# Altium schematic sheet 5V0 +12V0 rails.SchDoc
size A
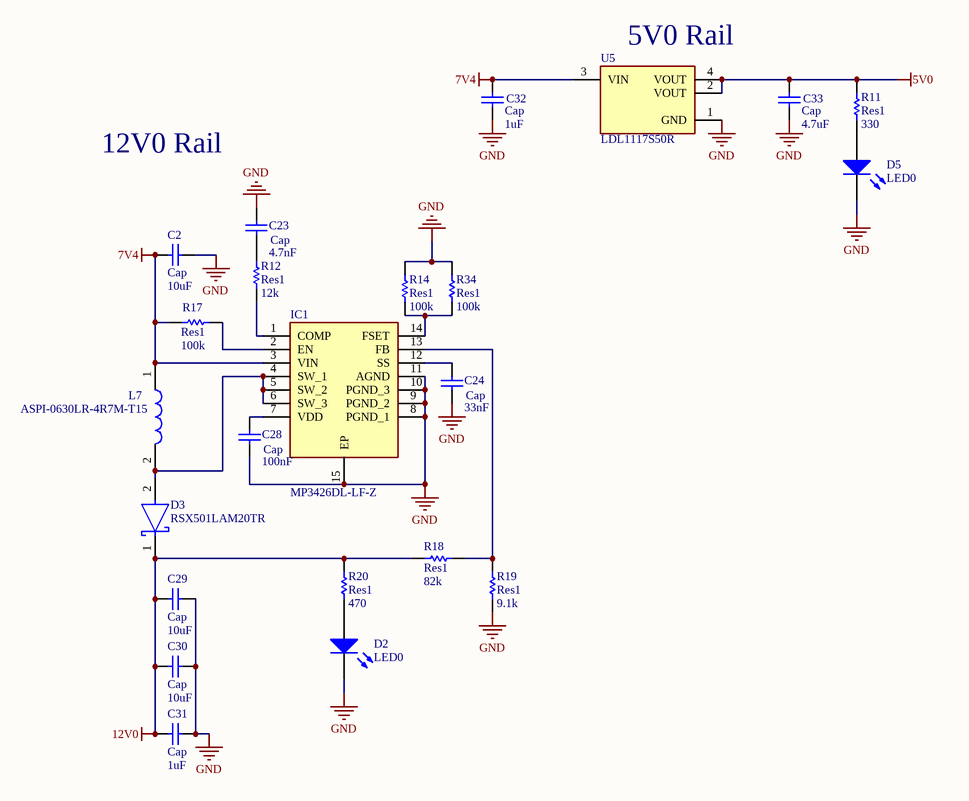
[diagram p0: 5V0 +12V0 rails.SchDoc]

## Parts
C2  Cap  value 10uF  [6-0805_M]
C23  Cap  value 4.7nF  [0402-A]
C24  Cap  value 33nF  [0402-A]
C28  Cap  value 100nF  [1608[0603]]
C29  Cap  value 10uF  [6-0805_M]
C30  Cap  value 10uF  [6-0805_M]
C31  Cap  value 1uF  [1608[0603]]
C32  Cap  value 1uF  [1608[0603]]
C33  Cap  value 4.7uF  [1608[0603]]
D2  LED0  [1608[0603]]
D3  RSX501LAM20TR  [FP-PMDTM-MFG]
D5  LED0  [1608[0603]]
IC1  MP3426DL-LF-Z  [SON50P300X400X100-15N-D]
L7  ASPI-0630LR-4R7M-T15  [ASPI-0630LR]
R11  Res1  value 330  [0402-A]
R12  Res1  value 12k  [0402-A]
R14  Res1  value 100k  [0402-A]
R17  Res1  value 100k  [0402-A]
R18  Res1  value 82k  [0402-A]
R19  Res1  value 9.1k  [0402-A]
R20  Res1  value 470  [6-0805_M]
R34  Res1  value 100k  [0402-A]
U5  LDL1117S50R  [FP-SOT-223-0046067_14-MFG]

## Nets
5V0: C33.2 R11.2 U5.2(VOUT) U5.4(VOUT)
7V4: C2.2 C32.2 IC1.3(VIN) L7.1 R17.2 U5.3(VIN)
12V0: C29.2 C30.2 C31.2 D3.1(C) R18.2 R20.2
GND: C2.1 C23.2 C24.1 C28.1 C29.1 C30.1 C31.1 C32.1 C33.1 D2.2(K) D5.2(K) IC1.8(PGND_1) IC1.9(PGND_2) IC1.10(PGND_3) IC1.11(AGND) IC1.15(EP) R14.1 R19.1 R34.1 U5.1(GND)
NetC23_1: C23.1 R12.1
NetC24_2: C24.2 IC1.12(SS)
NetC28_2: C28.2 IC1.7(VDD)
NetD2_1: D2.1(A) R20.1
NetD3_2: D3.2(A) IC1.4(SW_1) IC1.5(SW_2) IC1.6(SW_3) L7.2
NetD5_1: D5.1(A) R11.1
NetIC1_1: IC1.1(COMP) R12.2
NetIC1_2: IC1.2(EN) R17.1
NetIC1_13: IC1.13(FB) R18.1 R19.2
NetIC1_14: IC1.14(FSET) R14.2 R34.2

## Notes on the sheet
- (near U5) 5V0 Rail
- 12V0 Rail

## Library data of the parts
C2 C23 C24 C28-C33 = Cap: Capacitor; Published: 8-Jun-2000; LatestRevisionDate: 17-Jul-2002; LatestRevisionNote: Re-released for DXP Platform.; PackageReference: RAD-0.3; Publisher: Altium Limited; PackageDescription: Radial Cap, Thru-Hole; 2 Leads; 0.3 in Pin Spacing
D3 = CMP-08971-000008-1: DIODE SCHOTTKY 20V 5A PMDTM; Manufacturer: Rohm; Max Surge Forward Current: 100A; Max Junction Temp: +125°C; Max Repetitive Reverse Voltage: 25V; Peak Reverse Current: 500uA; Automotive: No; Digikey Description: DIODE SCHOTTKY 20V 5A PMDTM; Temperature Range High: +125°C; Height: 1.05mm; Octopart: https://octopart.com/rsx501lam20tr-rohm-82270774; Lead Free: Yes; ComponentLink2URL: https://fscdn.rohm.com/en/products/databook/datasheet/discrete/diode/schottky_barrier/rsx501lam20tr-e.pdf; Device Class L2: Diodes; ComponentLink2Description: Datasheet; Device Class L1: Discrete Semiconductors; RoHS: TRUE; Reverse Voltage: 20V; Package: PMDTM; Category: Diode; Temperature: to +125°C; Device Class L3: Schottky Diodes; Manufacturer Part Number: RSX501LAM20TR; Forward Current: 5A
IC1 = MP3426DL-LF-Z: Integrated Circuit; Manufacturer_Name: Monolithic Power Systems (MPS); Datasheet Link: https://www.monolithicpower.com/en/documentview/productdocument/index/version/2/document_type/Datasheet/lang/en/sku/MP3426/; Height: 1mm; Manufacturer_Part_Number: MP3426DL-LF-Z; Mouser Part Number: 946-MP3426DL-LF-Z; Mouser Price/Stock: https://www.mouser.co.uk/ProductDetail/Monolithic-Power-Systems-MPS/MP3426DL-LF-Z?qs=Z3CaLxJiOJL0MxCuEKYvhQ%3D%3D
L7 = ASPI-0630LR-4R7M-T15: Inductor; Manufacturer_Name: ABRACON; Datasheet Link: http://www.abracon.com/Magnetics/power/ASPI-0630LR.pdf; Manufacturer_Part_Number: ASPI-0630LR-4R7M-T15; Mouser Part Number: 815-ASPI0630LR4R7T15; Mouser Price/Stock: https://www.mouser.co.uk/ProductDetail/ABRACON/ASPI-0630LR-4R7M-T15?qs=bWAYEm3xoCYVuRmkzS1c6A%3D%3D; Arrow Part Number: ASPI-0630LR-4R7M-T15; Arrow Price/Stock: https://www.arrow.com/en/products/aspi-0630lr-4r7m-t15/abracon
R11 R12 R14 R17-R20 R34 = Res1: Resistor; Published: 8-Jun-2000; LatestRevisionDate: 17-Jul-2002; LatestRevisionNote: Re-released for DXP Platform.; PackageReference: AXIAL-0.3; Publisher: Altium Limited; PackageDescription: Axial Device, Thru-Hole; 2 Leads; 0.3 in Pin Spacing
U5 = CMP-12153-000005-1: IC REG LINEAR 5V 1.2A SOT223; Manufacturer: STMicroelectronics; Standoff Height: 0.02mm; Min Supply Voltage: 2.6V; Nominal Supply Current: 250uA; Max Junction Temp: +150°C; Accuracy Percentage: 2%; Output Type: Fixed; Max Supply Voltage: 18V; Output Current: 2A; Number Of Outputs: 1; Dropout Voltage: 350mV; ComponentLink2Description: Datasheet; Temperature Range High: +125°C; Manufacturer Part Number: LDL1117S50R; Digikey Description: IC REG LINEAR 5V 1.2A SOT223; Device Class L2: Power Management ICs; RoHS: TRUE; Temperature: -40°C to +125°C; Device Class L3: Voltage Regulators - Linear; Automotive: No; Mouser Description: LDL1117 Series 1.2 A 5 V High PSRR LDO Linear Voltage Regulator - SOT-223; Package: SOT-223-0046067_14; ComponentLink2URL: https://www.st.com/content/ccc/resource/technical/document/datasheet/group3/0e/5a/00/ca/10/1a/4f/a5/DM00366442/files/DM00366442.pdf/jcr:content/translations/en.DM00366442.pdf; Output Voltage: 5V; Octopart: https://octopart.com/ldl1117s50r-stmicroelectronics-81876164; Category: IC; Device Class L1: Integrated Circuits (ICs); Temperature Range Low: -40°C; Height: 1.9mm; Lead Free: Yes
D2 D5 = LED0: Published: 8-Jun-2000; LatestRevisionDate: 08-Jul-2005; LatestRevisionNote: Mech Layer 1 removed.; PackageReference: LED-0; Publisher: Altium Limited; PackageDescription: LED; 2 Leads